# Altium schematic sheet ETHERNET.SchDoc
size 381 x 139 mm; SheetNumber: 3; SheetTotal: 6
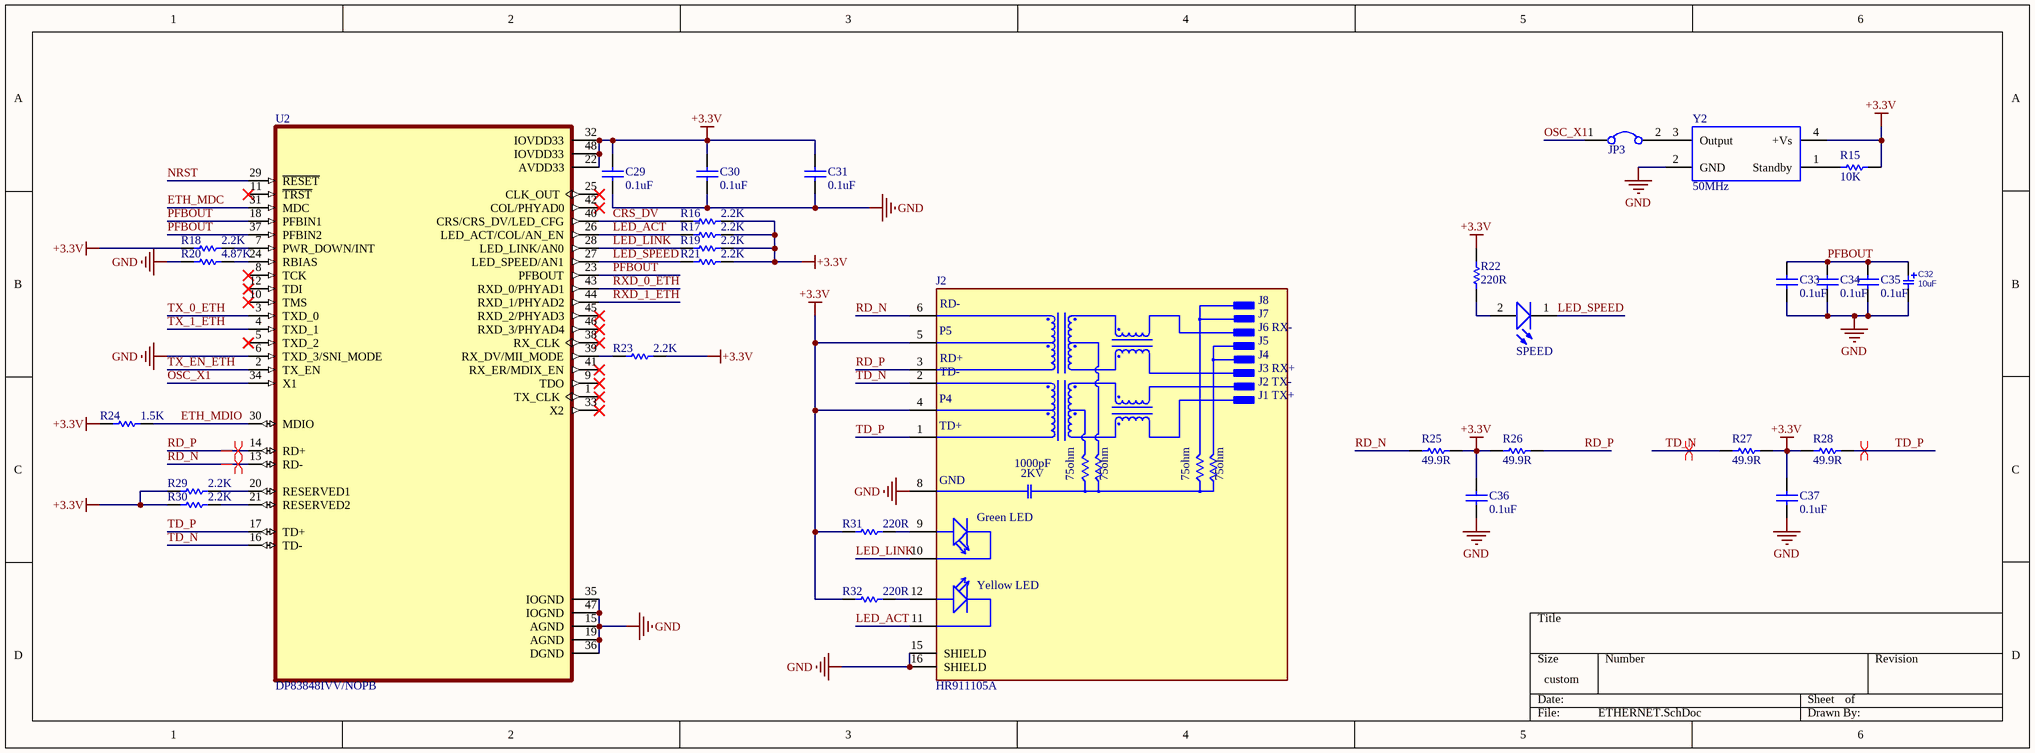
[diagram p0: ETHERNET.SchDoc]

## Parts
C29  0.1uF  [CAPC3413X12N]
C30  0.1uF  [CAPC3413X12N]
C31  0.1uF  [CAPC3413X12N]
C32  10uF  [C_TN_6032]
C33  0.1uF  [CAPC3413X12N]
C34  0.1uF  [CAPC3413X12N]
C35  0.1uF  [CAPC3413X12N]
C36  0.1uF  [CAPC3413X12N]
C37  0.1uF  [CAPC3413X12N]
J2  HR911105A  [HANRUN_HR911105A]
JP3  Jumper  [Jumper Small - 2.54 - GRAY]  (value not drawn)
R15  10K  [RESC3413X04N]
R16  2.2K  [RESC3413X04N]
R17  2.2K  [RESC3413X04N]
R18  2.2K  [RESC3413X04N]
R19  2.2K  [RESC3413X04N]
R20  4.87K  [RESC3413X04N]
R21  2.2K  [RESC3413X04N]
R22  220R  [RESC3413X04N]
R23  2.2K  [RESC3413X04N]
R24  1.5K  [RESC3413X04N]
R25  49.9R  [RESC3413X04N]
R26  49.9R  [RESC3413X04N]
R27  49.9R  [RESC3413X04N]
R28  49.9R  [RESC3413X04N]
R29  2.2K  [RESC3413X04N]
R30  2.2K  [RESC3413X04N]
R31  220R  [RESC3413X04N]
R32  220R  [RESC3413X04N]
SPEED  LED SMD PACKAGE  [LED_SMD_0805]  (value not drawn)
U2  DP83848IVV/NOPB  [LQFP-48]
Y2  50MHz  [WE-SPXO_CFPS-72]

## Nets
+3.3V: C29.2 C30.2 C31.2 C36.2 C37.2 J2.4(P4) J2.5(P5) R15.2 R16.2 R17.2 R18.1 R19.2 R21.2 R22.2 R23.2 R24.1 R25.2 R26.1 R27.2 R28.1 R29.1 R30.1 R31.1 R32.1 U2.22(AVDD33) U2.32(IOVDD33) U2.48(IOVDD33) Y2.4(+Vs)
GND: C29.1 C30.1 C31.1 C32.2 C33.1 C34.1 C35.1 C36.1 C37.1 J2.8(GND) J2.15(SHIELD) J2.16(SHIELD) R20.1 U2.6(TXD_3/SNI_MODE) U2.15(AGND) U2.19(AGND) U2.35(IOGND) U2.36(DGND) U2.47(IOGND) Y2.2(GND)
CRS_DV: R16.1 U2.40(CRS/CRS_DV/LED_CFG)
ETH_MDC: U2.31(MDC)
ETH_MDIO: R24.2 U2.30(MDIO)
LED_ACT: J2.11(YC) R17.1 U2.26(LED_ACT/COL/AN_EN)
LED_LINK: J2.10(GC) R19.1 U2.28(LED_LINK/AN0)
LED_SPEED: R21.1 SPEED.1(K) U2.27(LED_SPEED/AN1)
NRST: U2.29(~{RESET})
OSC_X1: JP3.1 U2.34(X1)
PFBOUT: C32.1 C33.2 C34.2 C35.2 U2.18(PFBIN1) U2.23(PFBOUT) U2.37(PFBIN2)
RD_N: J2.6(RD-) R25.1 U2.13(RD-)
RD_P: J2.3(RD+) R26.2 U2.14(RD+)
RXD_0_ETH: U2.43(RXD_0/PHYAD1)
RXD_1_ETH: U2.44(RXD_1/PHYAD2)
TD_N: J2.2(TD-) R27.1 U2.16(TD-)
TD_P: J2.1(TD+) R28.2 U2.17(TD+)
TX_0_ETH: U2.3(TXD_0)
TX_1_ETH: U2.4(TXD_1)
TX_EN_ETH: U2.2(TX_EN)
NetJ2_9: J2.9(GA) R31.2
NetJ2_12: J2.12(YA) R32.2
NetJP3_2: JP3.2 Y2.3(Output)
NetR15_1: R15.1 Y2.1(Standby)
NetR18_2: R18.2 U2.7(PWR_DOWN/INT)
NetR20_2: R20.2 U2.24(RBIAS)
NetR22_1: R22.1 SPEED.2(A)
NetR23_1: R23.1 U2.39(RX_DV/MII_MODE)
NetR29_2: R29.2 U2.20(RESERVED1)
NetR30_2: R30.2 U2.21(RESERVED2)

Not connected (* = marked no-connect by the designer): U2 1(TX_CLK)* 5(TXD_2)* 8(TCK)* 9(TDO)* 10(TMS)* 11(~{TRST})* 12(TDI)* 25(CLK_OUT)* 33(X2)* 38(RX_CLK)* 41(RX_ER/MDIX_EN)* 42(COL/PHYAD0)* 45(RXD_2/PHYAD3)* 46(RXD_3/PHYAD4)*

## Layout directives
differential pair: RD_N, RD_P, TD_N, TD_P

## Notes on the sheet
- (in symbol HR911105A) J8; J7; J6 RX-; J5; J4; J3 RX+; J2 TX-; J1 TX+; 1000pF; 2KV; 75ohm; Green LED; Yellow LED

## Library data of the parts
C29-C31 C33-C37 = CAP SMD 0805: CAP 0805; Designer: Abbas Basereh; Desc.: CAP SMD 0805; Data: 16-12-2016
C32 = CAP_SMD_TAN: CAP, SMD, TAN,; PARAM: 25V; VALUE: 10uF
J2 = HR911105A: DIP RJ45 Connector;; MF: hanrun; SnapEDA_Link: https://www.snapeda.com/parts/HR911105A/HanRun/view-part/?ref=snap; Package: None; MP: HR911105A; Check_prices: https://www.snapeda.com/parts/HR911105A/HanRun/view-part/?ref=eda; Price: None; Value: *; Availability: Not in stock
JP3 = Jumper: Company: E.P.I.L; Defualt State: Close; Design Date: 2011/11/02
R15-R32 = RES 0805 0.125W: RES 0805; Designer: Abbas Basereh; Desc.: RES SMD 0805; Data: 16-12-2016
SPEED = LED SMD PACKAGE: SMD Mono-color Chip LED Waterclear; Part Number: 150080BS75000; Peak Wavelength: 465 nm; Forward Voltage: 3.2 V; Published Date: Jan 2017; Publisher: Ali Hafizi
U2 = DP83848IVV/NOPB: Industrial temperature, 10/100-Mbps Ethernet PHY transceiver with SNI & JTAG support 48-LQFP -40 to 85; MF: Texas Instruments; DigiKey-Purchase-URL: https://snapeda.com/shop?store=DigiKey&id=45764; Package: LQFP-48 Texas Instruments; Arrow_Electronics-Purchase-URL: https://snapeda.com/shop?store=Arrow+Electronics&id=45764; MP: DP83848IVV/NOPB; Value: *; Texas_Instruments-Purchase-URL: https://snapeda.com/shop?store=Texas+Instruments&id=45764; Availability: Good; Price: None; SnapEDA_Link: https://www.snapeda.com/parts/DP83848IVV/NOPB/Texas%20Instruments/view-part/45764/?ref=snap; Mouser-Purchase-URL: https://snapeda.com/shop?store=Mouser&id=45764
Y2 = 831009443: WE-SPXO Simple Packaged Quartz Oscillator, SMT, CFPS-72, 80MHz, 5V; Manufacturer: Wurth Elektronik; Frequency Stability: +/-50ppm; ComponentLink1URL: http://www.we-online.de; ComponentLink2URL: https://katalog.we-online.com/pbs/datasheet/831009443.pdf; Supply Voltage: 5V; Size: CFPS-72; Packaging: Tape and Reel; Operating Temperature: 0 to +70degC; Mounting Technology: SMT; Published Date: July 2020; ComponentLink1Description: Manufacturer; Manufacturer Part Number: 831009443; Frequency: 80MHz; ComponentLink2Description: Datasheet